# EAGLE design MemcalShort_27C010 (EAGLE 9.5.1)
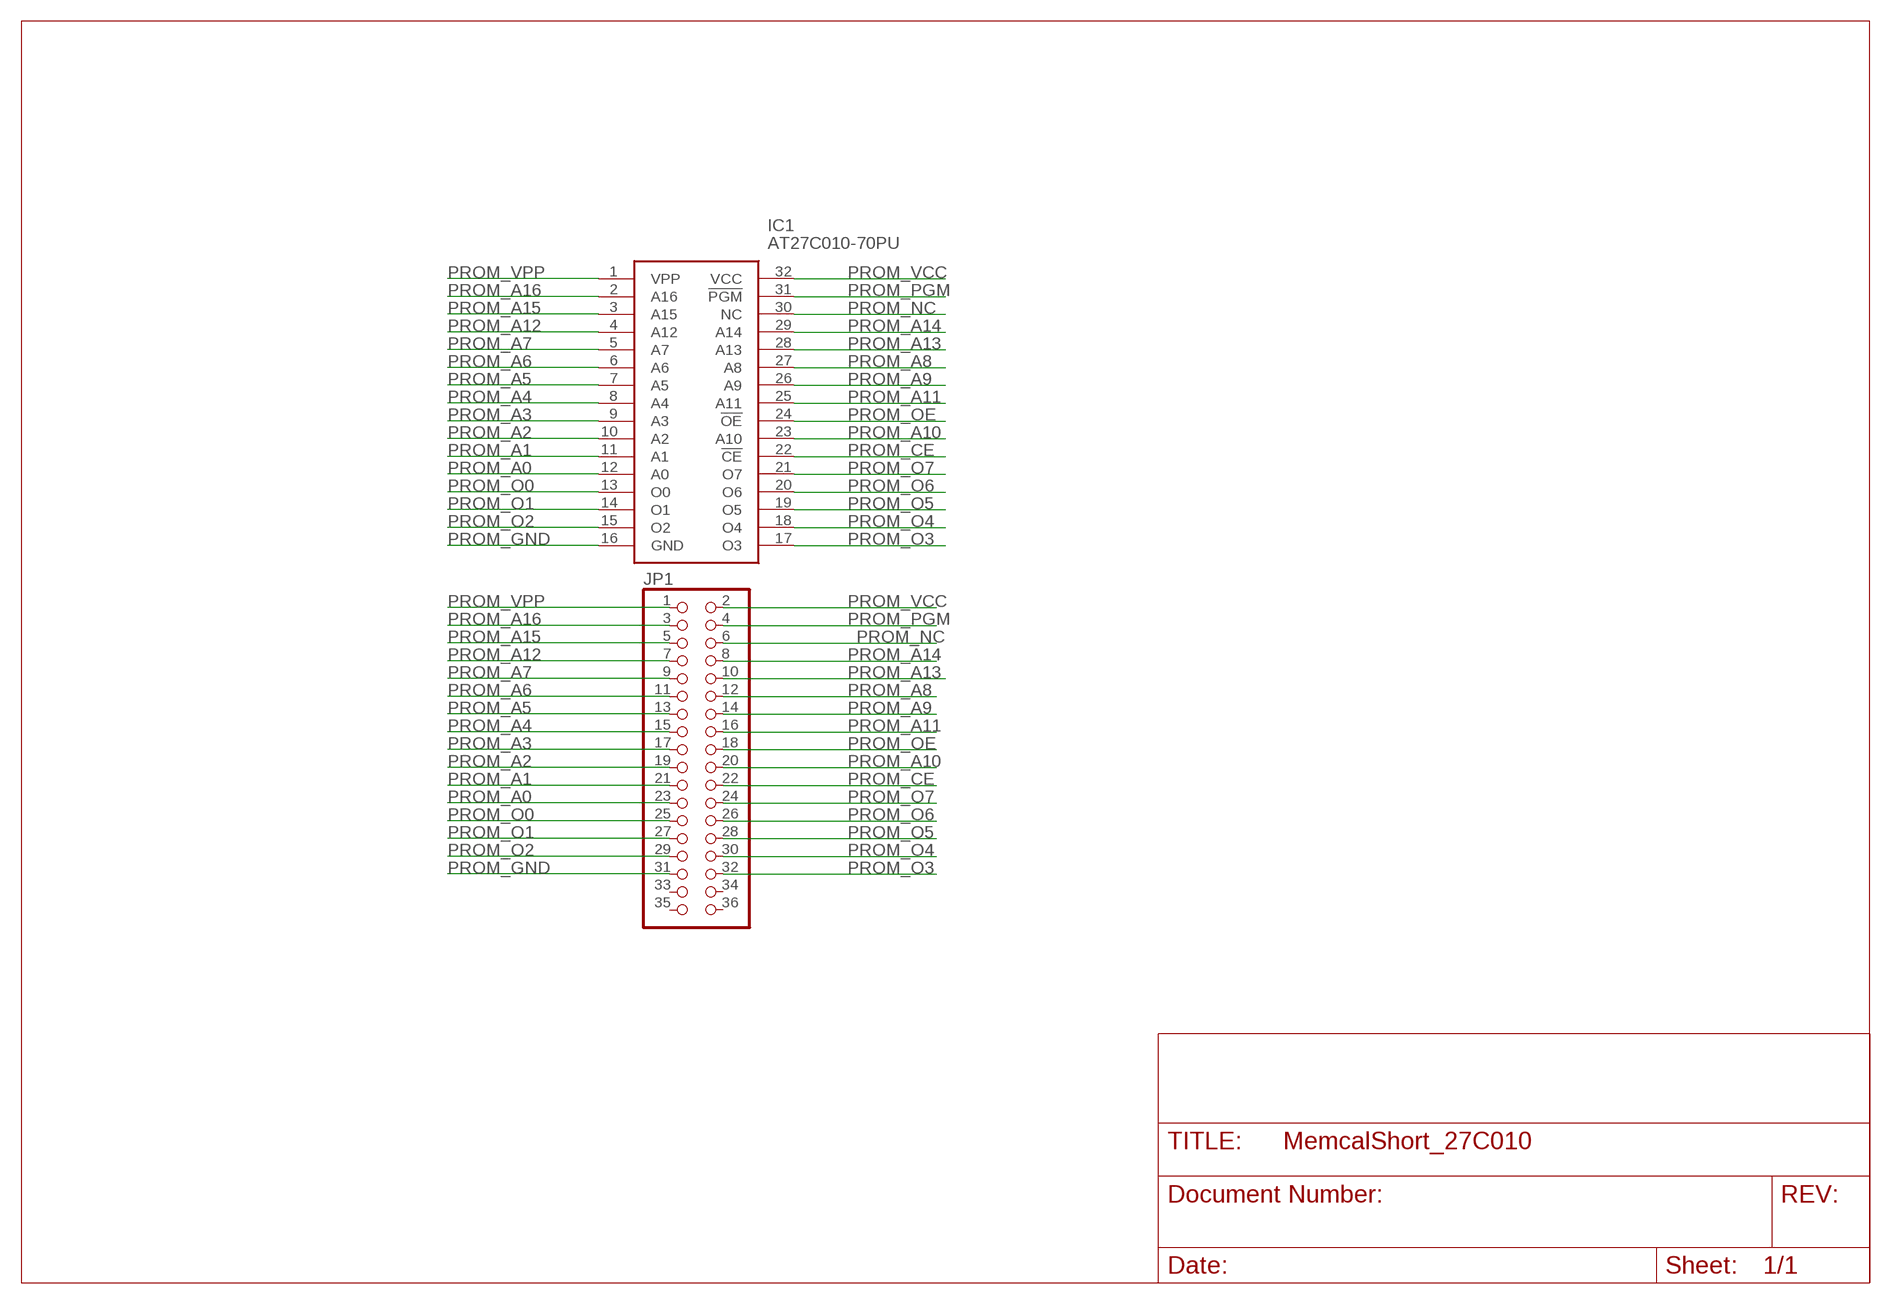
[diagram p0: schematic, sheet 1]

## Parts
IC1  AT27C010-70PU  [DIP1556W56P254L4204H483Q32N]
JP1  PINHD-2X18  [2X18]

## Nets
PROM_A0: IC1.12(A0) JP1.23
PROM_A1: IC1.11(A1) JP1.21
PROM_A2: IC1.10(A2) JP1.19
PROM_A3: IC1.9(A3) JP1.17
PROM_A4: IC1.8(A4) JP1.15
PROM_A5: IC1.7(A5) JP1.13
PROM_A6: IC1.6(A6) JP1.11
PROM_A7: IC1.5(A7) JP1.9
PROM_A8: IC1.27(A8) JP1.12
PROM_A9: IC1.26(A9) JP1.14
PROM_A10: IC1.23(A10) JP1.20
PROM_A11: IC1.25(A11) JP1.16
PROM_A12: IC1.4(A12) JP1.7
PROM_A13: IC1.28(A13) JP1.10
PROM_A14: IC1.29(A14) JP1.8
PROM_A15: IC1.3(A15) JP1.5
PROM_A16: IC1.2(A16) JP1.3
PROM_CE: IC1.22(!CE) JP1.22
PROM_GND: IC1.16(GND) JP1.31
PROM_NC: IC1.30(NC) JP1.6
PROM_O0: IC1.13(O0) JP1.25
PROM_O1: IC1.14(O1) JP1.27
PROM_O2: IC1.15(O2) JP1.29
PROM_O3: IC1.17(O3) JP1.32
PROM_O4: IC1.18(O4) JP1.30
PROM_O5: IC1.19(O5) JP1.28
PROM_O6: IC1.20(O6) JP1.26
PROM_O7: IC1.21(O7) JP1.24
PROM_OE: IC1.24(!OE) JP1.18
PROM_PGM: IC1.31(!PGM) JP1.4
PROM_VCC: IC1.32(VCC) JP1.2
PROM_VPP: IC1.1(VPP) JP1.1
Unconnected: JP1.33 JP1.34 JP1.35 JP1.36

## Library data of the parts
IC1 = AT27C010-70PU:AT27C010-70PU: Microchip Technology AT27C010-70PU, EPROM 1Mbit 128K x 8 bit 70ns 32-Pin PDIP Source: Datasheet <https://componentsearchengine.com/Datasheets/1/AT27C010-70PU.pdf>; ARROW_PART_NUMBER: AT27C010-70PU; ARROW_PRICE-STOCK: https://www.arrow.com/en/products/at27c010-70pu/microchip-technology; DESCRIPTION: Microchip Technology AT27C010-70PU, EPROM 1Mbit 128K x 8 bit 70ns 32-Pin PDIP; HEIGHT: 4.826mm; MANUFACTURER_NAME: Microchip; MANUFACTURER_PART_NUMBER: AT27C010-70PU; MOUSER_PART_NUMBER: 556-AT27C01070PU; MOUSER_PRICE-STOCK: https://www.mouser.co.uk/ProductDetail/Microchip-Technology-Atmel/AT27C010-70PU?qs=lURXKZrvvXcyOgzz37%2FYjw%3D%3D
JP1 = pinhead:PINHD-2X18: PIN HEADER

## Board
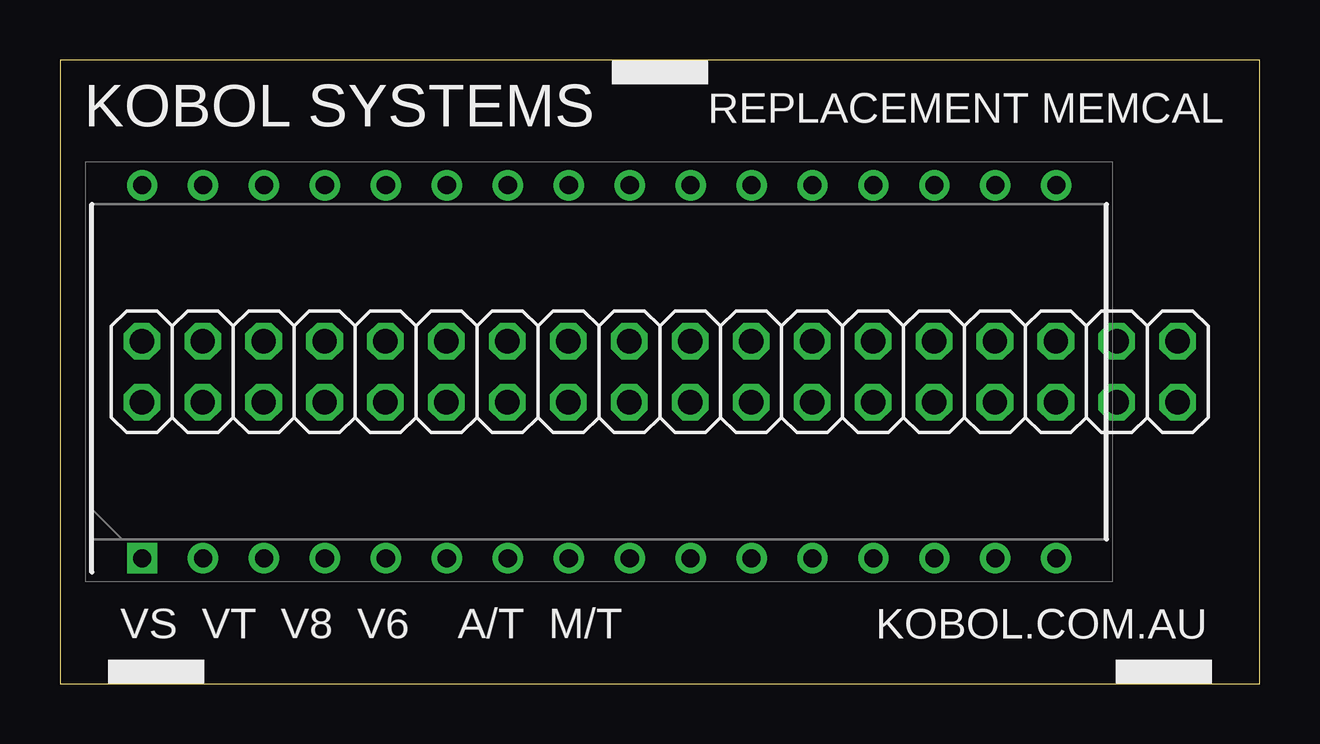
[diagram p1: board, top side]
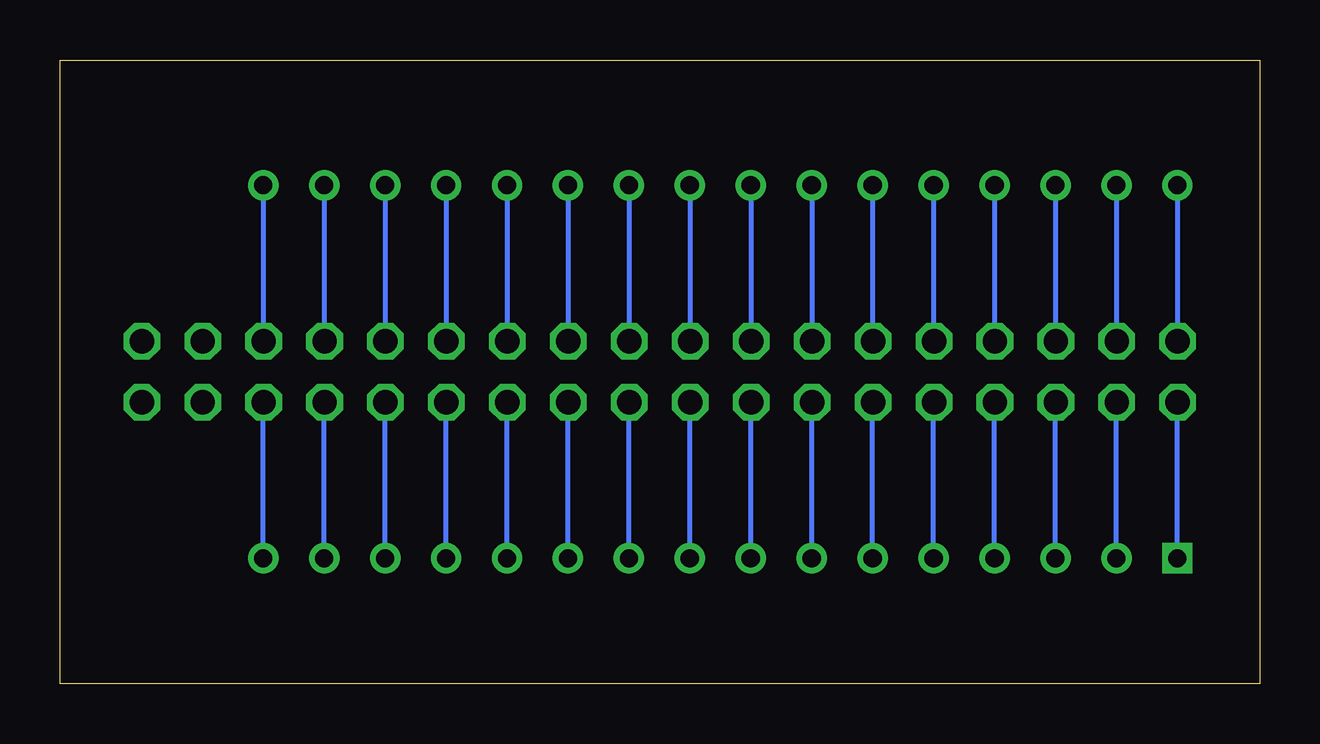
[diagram p2: board, bottom side, seen from below]

Size 50 x 26 mm. Coordinates in mm from the lower left corner, seen from the top.
Outline: 0,0 50,0 50,26 0,26 0,0
Copper layers (1*16): Top 0.035mm / dielectric 1.5mm / Bottom 0.035mm
Design rules "default": minimum track width 6mil, minimum drill 0.35mm, track to track 6mil, track to pad 6mil, pad to pad 6mil, via to via 6mil, smd to smd 6mil, copper to edge 40mil, drill to drill 6mil, minimum pad ring 10mil, minimum via ring 8mil, stop-mask expansion 4mil, vias tented up to drill 0mil, thermal gap 10mil

### Footprints (pad centres in the part's own frame; a part is rotated, then mirrored left to right if it is on the bottom)
DIP1556W56P254L4204H483Q32N = drill 0.759 pad 1.159 square: 1 -7.779,19.05 | drill 0.759 pad 1.159: 2 -7.779,16.51; 3 -7.779,13.97; 4 -7.779,11.43; 5 -7.779,8.89; 6 -7.779,6.35; 7 -7.779,3.81; 8 -7.779,1.27; 9 -7.779,-1.27; 10 -7.779,-3.81; 11 -7.779,-6.35; 12 -7.779,-8.89; 13 -7.779,-11.43; 14 -7.779,-13.97; 15 -7.779,-16.51; 16 -7.779,-19.05; 17 7.779,-19.05; 18 7.779,-16.51; 19 7.779,-13.97; 20 7.779,-11.43; 21 7.779,-8.89; 22 7.779,-6.35; 23 7.779,-3.81; 24 7.779,-1.27; 25 7.779,1.27; 26 7.779,3.81; 27 7.779,6.35; 28 7.779,8.89; 29 7.779,11.43; 30 7.779,13.97; 31 7.779,16.51; 32 7.779,19.05
2X18 = drill 1.016 octagon: 1 -21.59,-1.27; 2 -21.59,1.27; 3 -19.05,-1.27; 4 -19.05,1.27; 5 -16.51,-1.27; 6 -16.51,1.27; 7 -13.97,-1.27; 8 -13.97,1.27; 9 -11.43,-1.27; 10 -11.43,1.27; 11 -8.89,-1.27; 12 -8.89,1.27; 13 -6.35,-1.27; 14 -6.35,1.27; 15 -3.81,-1.27; 16 -3.81,1.27; 17 -1.27,-1.27; 18 -1.27,1.27; 19 1.27,-1.27; 20 1.27,1.27; 21 3.81,-1.27; 22 3.81,1.27; 23 6.35,-1.27; 24 6.35,1.27; 25 8.89,-1.27; 26 8.89,1.27; 27 11.43,-1.27; 28 11.43,1.27; 29 13.97,-1.27; 30 13.97,1.27; 31 16.51,-1.27; 32 16.51,1.27; 33 19.05,-1.27; 34 19.05,1.27; 35 21.59,-1.27; 36 21.59,1.27

### Placement (x,y rotation side)
IC1  22.48,13 90 top
JP1  25,13 0 top

### Tracks (layer width: path | path; a pad name or v marks a point on that pad's centre or on a via)
PROM_A0
  Bottom 0.203: IC1.12 31.37,11.71 JP1.23
PROM_A1
  Bottom 0.203: IC1.11 28.83,11.71 JP1.21
PROM_A2
  Bottom 0.203: IC1.10 26.29,11.71 JP1.19
PROM_A3
  Bottom 0.203: IC1.9 23.75,11.71 JP1.17
PROM_A4
  Bottom 0.203: IC1.8 21.21,11.71 JP1.15
PROM_A5
  Bottom 0.203: IC1.7 18.67,11.71 JP1.13
PROM_A6
  Bottom 0.203: IC1.6 16.13,11.71 JP1.11
PROM_A7
  Bottom 0.203: IC1.5 13.59,11.71 JP1.9
PROM_A8
  Bottom 0.203: IC1.27 16.13,14.29 JP1.12
PROM_A9
  Bottom 0.203: IC1.26 18.67,14.29 JP1.14
PROM_A10
  Bottom 0.203: IC1.23 26.29,14.29 JP1.20
PROM_A11
  Bottom 0.203: IC1.25 21.21,14.29 JP1.16
PROM_A12
  Bottom 0.203: IC1.4 11.05,11.71 JP1.7
PROM_A13
  Bottom 0.203: IC1.28 13.59,14.29 JP1.10
PROM_A14
  Bottom 0.203: IC1.29 11.05,14.29 JP1.8
PROM_A15
  Bottom 0.203: IC1.3 8.51,11.71 JP1.5
PROM_A16
  Bottom 0.203: IC1.2 5.97,11.71 JP1.3
PROM_CE
  Bottom 0.203: IC1.22 28.83,14.29 JP1.22
PROM_GND
  Bottom 0.203: IC1.16 41.53,11.71 JP1.31
PROM_NC
  Bottom 0.203: IC1.30 8.51,14.29 JP1.6
PROM_O0
  Bottom 0.203: IC1.13 33.91,11.71 JP1.25
PROM_O1
  Bottom 0.203: IC1.14 36.45,11.71 JP1.27
PROM_O2
  Bottom 0.203: IC1.15 38.99,11.71 JP1.29
PROM_O3
  Bottom 0.203: IC1.17 41.53,14.29 JP1.32
PROM_O4
  Bottom 0.203: IC1.18 38.99,14.29 JP1.30
PROM_O5
  Bottom 0.203: IC1.19 36.45,14.29 JP1.28
PROM_O6
  Bottom 0.203: IC1.20 33.91,14.29 JP1.26
PROM_O7
  Bottom 0.203: IC1.21 31.37,14.29 JP1.24
PROM_OE
  Bottom 0.203: IC1.24 23.75,14.29 JP1.18
PROM_PGM
  Bottom 0.203: IC1.31 5.97,14.29 JP1.4
PROM_VCC
  Bottom 0.203: IC1.32 3.43,14.29 JP1.2
PROM_VPP
  Bottom 0.203: IC1.1 3.43,11.71 JP1.1

### Text on the board
tPlace: KOBOL SYSTEMS | REPLACEMENT MEMCAL | VS VT V8 V6 A/T M/T | KOBOL.COM.AU